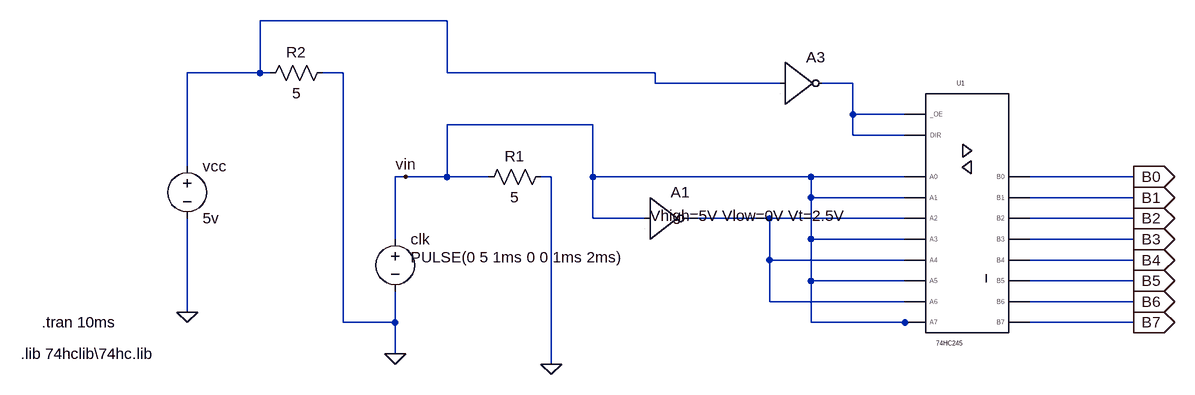
[diagram p0: schematic bus-buf-74hc245-test.asc]
bus-buf-74hc245-test.asc, the LTspice schematic file:
Version 4
SHEET 1 880 680
WIRE -608 -320 -896 -320
WIRE -896 -240 -896 -320
WIRE -896 -240 -1008 -240
WIRE -880 -240 -896 -240
WIRE -768 -240 -800 -240
WIRE -608 -240 -608 -320
WIRE -288 -240 -608 -240
WIRE -288 -224 -288 -240
WIRE -96 -224 -288 -224
WIRE 16 -224 -32 -224
WIRE 16 -176 16 -224
WIRE 96 -176 16 -176
WIRE -384 -160 -608 -160
WIRE 16 -144 16 -176
WIRE 96 -144 16 -144
WIRE -1008 -96 -1008 -240
WIRE -672 -80 -688 -80
WIRE -608 -80 -608 -160
WIRE -608 -80 -672 -80
WIRE -544 -80 -608 -80
WIRE -448 -80 -464 -80
WIRE -384 -80 -384 -160
WIRE -48 -80 -384 -80
WIRE 96 -80 -48 -80
WIRE 448 -80 288 -80
WIRE -48 -48 -48 -80
WIRE 96 -48 -48 -48
WIRE 448 -48 288 -48
WIRE -384 -16 -384 -80
WIRE -304 -16 -384 -16
WIRE -112 -16 -240 -16
WIRE 96 -16 -112 -16
WIRE 448 -16 288 -16
WIRE -688 16 -688 -80
WIRE -48 16 -48 -48
WIRE 96 16 -48 16
WIRE 448 16 288 16
WIRE -112 48 -112 -16
WIRE 96 48 -112 48
WIRE 448 48 288 48
WIRE -48 80 -48 16
WIRE 96 80 -48 80
WIRE 448 80 288 80
WIRE -112 112 -112 48
WIRE 96 112 -112 112
WIRE 448 112 288 112
WIRE -1008 128 -1008 -16
WIRE -768 144 -768 -240
WIRE -688 144 -688 96
WIRE -688 144 -768 144
WIRE -48 144 -48 80
WIRE 96 144 -48 144
WIRE 112 144 96 144
WIRE 448 144 288 144
WIRE -688 192 -688 144
WIRE -448 208 -448 -80
FLAG -688 192 0
FLAG 448 -48 B1
IOPIN 448 -48 Out
FLAG 448 -16 B2
IOPIN 448 -16 Out
FLAG 448 16 B3
IOPIN 448 16 Out
FLAG 448 48 B4
IOPIN 448 48 Out
FLAG 448 80 B5
IOPIN 448 80 Out
FLAG 448 112 B6
IOPIN 448 112 Out
FLAG 448 144 B7
IOPIN 448 144 Out
FLAG 448 -80 B0
IOPIN 448 -80 Out
FLAG -1008 128 0
FLAG -448 208 0
FLAG -672 -80 vin
SYMBOL voltage -688 0 R0
WINDOW 3 24 44 Left 2
WINDOW 123 0 0 Left 2
WINDOW 39 0 0 Left 2
SYMATTR Value PULSE(0 5 1ms 0 0 1ms 2ms)
SYMATTR InstName clk
SYMBOL 74hc245 192 -240 R0
SYMATTR InstName U1
SYMBOL Digital\\inv -96 -288 R0
SYMATTR InstName A3
SYMBOL voltage -1008 -112 R0
WINDOW 123 0 0 Left 2
WINDOW 39 0 0 Left 2
SYMATTR InstName vcc
SYMATTR Value 5v
SYMBOL Digital\\inv -304 -80 R0
WINDOW 39 8 60 Left 2
SYMATTR SpiceLine Vhigh=5V Vlow=0V Vt=2.5V
SYMATTR InstName A1
SYMBOL res -448 -96 R90
WINDOW 0 0 56 VBottom 2
WINDOW 3 32 56 VTop 2
SYMATTR InstName R1
SYMATTR Value 5
SYMBOL res -784 -256 R90
WINDOW 0 0 56 VBottom 2
WINDOW 3 32 56 VTop 2
SYMATTR InstName R2
SYMATTR Value 5
TEXT -1232 144 Left 2 !.tran 10ms
TEXT -1264 192 Left 2 !.lib 74hclib\\74hc.lib

The netlist it stands for:
* bus-buf-74hc245-test.asc
V§clk vin 0 PULSE(0 5 1ms 0 0 1ms 2ms)
XU1 N002 N002 vin vin N003 vin N003 vin N003 vin B0 B1 B2 B3 B4 B5 B6 B7 VCC 0 74HC245 VCC=5  SPEED=1.0  TRIPDT=1e-9  ; pins OE DIR D0 D1 D2 D3 D4 D5 D6 D7 Q0 Q1 Q2 Q3 Q4 Q5 Q6 Q7
A3 N001 0 0 0 0 N002 0 0 BUF
vcc N001 0 5v
A1 vin 0 0 0 0 N003 0 0 BUF Vhigh=5V Vlow=0V Vt=2.5V
R1 0 vin 5
R2 0 N001 5
.tran 10ms
.lib 74hclib\74hc.lib
.backanno
.end